# EAGLE design defi_schutz (EAGLE 9.5.2)
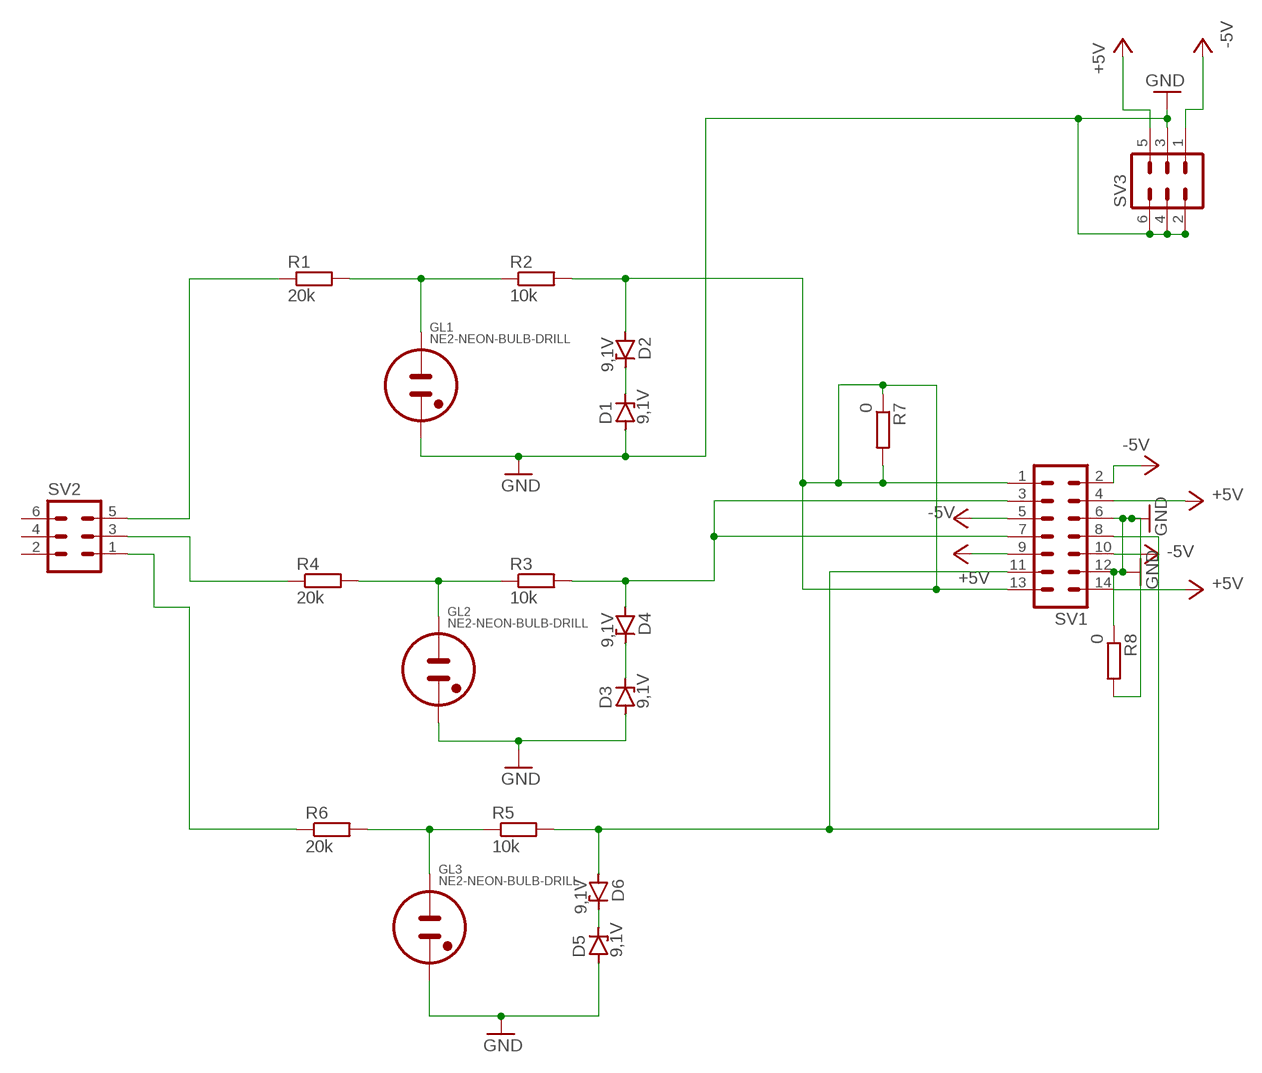
[diagram p0: schematic, sheet 1]

## Parts
D1  9,1V  1N4728  [DO41Z10]
D2  9,1V  1N4728  [DO41Z10]
D3  9,1V  1N4728  [DO41Z10]
D4  9,1V  1N4728  [DO41Z10]
D5  9,1V  1N4728  [DO41Z10]
D6  9,1V  1N4728  [DO41Z10]
GL1  NE2-NEON-BULB-DRILL  [NE2-NEON-BULB-DRILL]
GL2  NE2-NEON-BULB-DRILL  [NE2-NEON-BULB-DRILL]
GL3  NE2-NEON-BULB-DRILL  [NE2-NEON-BULB-DRILL]
R1  20k  R-EU_0207/10  [0207/10]
R2  10k  R-EU_0207/10  [0207/10]
R3  10k  R-EU_0207/10  [0207/10]
R4  20k  R-EU_0207/10  [0207/10]
R5  10k  R-EU_0207/10  [0207/10]
R6  20k  R-EU_0207/10  [0207/10]
R7  0  R-EU_0207/15  [0207/15]
R8  0  R-EU_0207/15  [0207/15]
SV1  ML14L  [ML14L]
SV2  ML6L  [ML6L]
SV3  ML6L  [ML6L]

## Nets
+5V: SV1.4 SV1.9 SV1.14 SV3.5
-5V: SV1.2 SV1.5 SV1.10 SV3.1
GND: D1.A D3.A D5.A GL1.2(A1) GL2.2(A1) GL3.2(A1) R8.1 R8.2 SV1.6 SV1.12 SV3.2 SV3.3 SV3.4 SV3.6
N$1: GL2.1(A) R3.1 R4.2
N$2: D4.A R3.2 SV1.3 SV1.7
N$3: D3.C D4.C
N$4: D1.C D2.C
N$5: GL1.1(A) R1.2 R2.1
N$6: D2.A R2.2 R7.1 R7.2 SV1.1 SV1.13
N$7: GL3.1(A) R5.1 R6.2
N$8: D6.A R5.2 SV1.8 SV1.11
N$9: D5.C D6.C
N$10: R1.1 SV2.5
N$11: R4.1 SV2.3
N$12: R6.1 SV2.1
Unconnected: SV2.2 SV2.4 SV2.6

## Library data of the parts
D1-D6 = diode:1N4728: Z DIODE 3.3 V, 1W, 5 percent
GL1-GL3 = nixie_tube:NE2-NEON-BULB: Neon indicator (wire connection)
R1-R8 = rcl:R-EU_: RESISTOR, European symbol; SPICEPREFIX: R
SV1 = con-harting-ml:ML14: HARTING; OC_FARNELL: unknown; OC_NEWARK: unknown
SV2 SV3 = con-harting-ml:ML6: HARTING; OC_FARNELL: unknown; OC_NEWARK: unknown

## Board
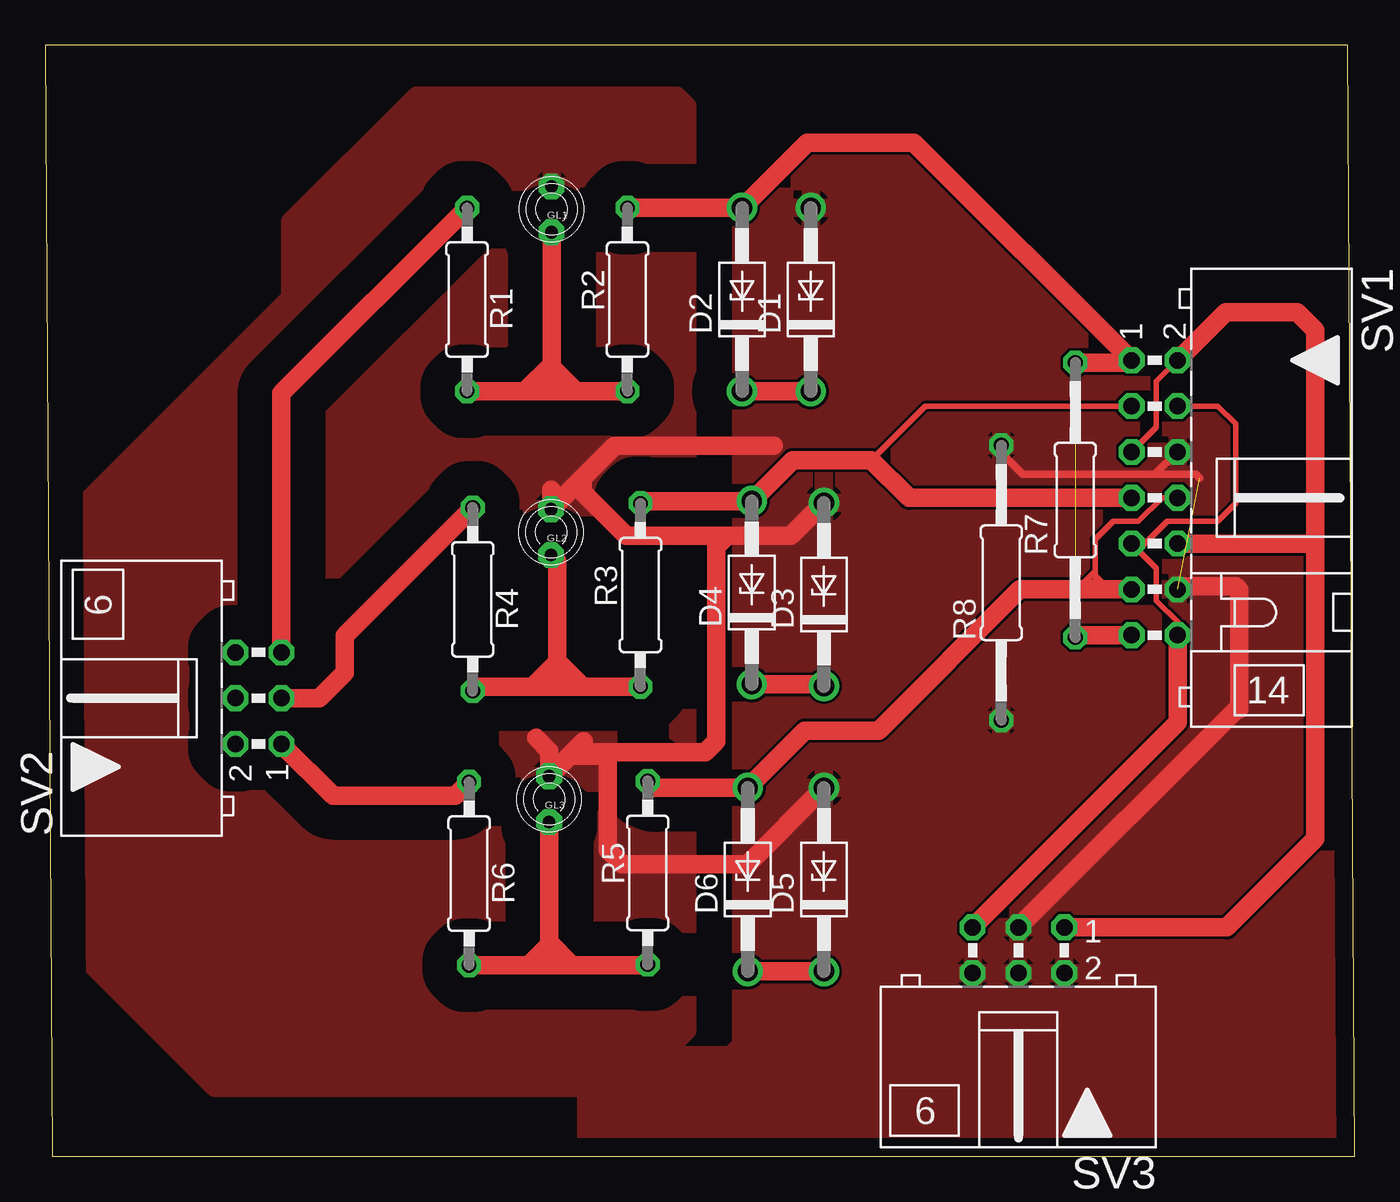
[diagram p1: board, top side]

Size 72.6 x 61.6 mm. Coordinates in mm from the lower left corner, seen from the top.
Outline: 0.4,0 72.6,0 72.2,61.6 0,61.6 0.4,0
Copper layers (1*16): Top 0.035mm / dielectric 1.5mm / Bottom 0.035mm
Design rules "default": minimum track width 6mil, minimum drill 0.35mm, track to track 6mil, track to pad 6mil, pad to pad 6mil, via to via 6mil, smd to smd 6mil, copper to edge 40mil, drill to drill 6mil, minimum pad ring 10mil, minimum via ring 8mil, stop-mask expansion 4mil, vias tented up to drill 0mil, thermal gap 10mil

### Footprints (pad centres in the part's own frame; a part is rotated, then mirrored left to right if it is on the bottom)
DO41Z10 = drill 1.118: A 5.08,0; C -5.08,0
NE2-NEON-BULB-DRILL = drill 0.7 pad 1.422 octagon: 1 0,1.27; 2 0,-1.27
0207/10 = drill 0.813 octagon: 1 -5.08,0; 2 5.08,0
0207/15 = drill 0.813 octagon: 1 -7.62,0; 2 7.62,0
ML14L = drill 0.914 octagon: 1 -7.62,-1.27; 2 -7.62,1.27; 3 -5.08,-1.27; 4 -5.08,1.27; 5 -2.54,-1.27; 6 -2.54,1.27; 7 0,-1.27; 8 0,1.27; 9 2.54,-1.27; 10 2.54,1.27; 11 5.08,-1.27; 12 5.08,1.27; 13 7.62,-1.27; 14 7.62,1.27
ML6L = drill 0.914 octagon: 1 -2.54,-1.27; 2 -2.54,1.27; 3 0,-1.27; 4 0,1.27; 5 2.54,-1.27; 6 2.54,1.27

### Placement (x,y rotation side)
D1  42.44,47.5 90 top
D2  38.63,47.5 90 top
D3  43.17,31.15 90 top
D4  39.17,31.25 90 top
D5  43.17,15.35 90 top
D6  38.95,15.35 90 top
GL1  28.07,52.5 180 top
GL2  28.05,34.6 180 top
GL3  27.94,19.8 180 top
R1  23.39,47.5 270 top
R2  32.28,47.5 90 top
R3  33,31.12 90 top
R4  23.7,30.88 270 top
R5  33.4,15.72 90 top
R6  23.5,15.68 270 top
R7  57.1,36.38 90 top
R8  53,31.8 90 top
SV1  61.5,36.51 270 top
SV2  11.83,25.4 90 top
SV3  53.95,11.43 180 top

### Tracks (layer width: path | path; a pad name or v marks a point on that pad's centre or on a via)
+5V
  Top 0.305: SV1.4 65.01,41.59 66,40.6 66,36.2 65,35.2 62.2,35.2 60.6,33.6 | 60.23,34.37 SV1.9 60.6,33.6 | SV1.14 62.77,29.63 61.6,30.8 61.6,32.6 60.6,33.6
  Top 1.016: SV3.5 62.77,24.06 SV1.14
-5V
  Top 0.305: SV1.5 61.6,40.42 61.6,42.96 SV1.2
  Top 1.016: SV1.2 65.44,46.8 69.4,46.8 70.4,45.8 70.4,34 | SV3.1 65.5,12.7 70.4,17.6 70.4,34 | SV1.10 70.37,33.97 70.4,34
GND  (1 unrouted)
  Top 0.406: SV1.6 61.52,37.8 | 53,39 54.2,37.8 61.52,37.8 | 61.52,37.8 63.8,37.8 64,37.6
  Top 1.016: GL3.2 27.94,22.47 27.21,23.2 | 28.05,36.95 GL2.2 29.79,37.61 | 29.79,37.61 31.58,39.4 40.4,39.4 | GL3.2 29.87,23 | SV1.12 62.94,31.6 66,31.6 66.2,31.4 66.2,24.8 66.05,24.8 SV3.3 | D5.A 38.94,16.2 32,16.2 31.2,17 31.2,22.2 29.07,22.2 GL3.2 | D3.A 41.34,34.4 37.8,34.4 | 37.8,34.4 32.2,34.4 29.79,36.81 29.79,37.61 | GL3.2 29.27,22.4 36.6,22.4 37.2,23 37.2,33.8 37.8,34.4
  pour Top (isolate 1.93): 35.6,7 35.6,58.2 35,58.8 20.6,58.8 13.6,51.8 13.6,47.6 -2.4,31.6 -2.4,15.6 9.4,3.8 32.4,3.8
  pour Top: 30,5.6 38,5.6 38.6,6.2 38.6,54.2 35.8,57 32.6,57 33.8,58.2 33.8,61 78,61 78,-5 30,-5
N$1
  Top 1.016: R4.2 23.94,26.04 27.2,26.04 | 27.2,26.04 28.4,26.04 | 28.4,26.04 29.8,26.04 | 29.8,26.04 R3.1 | GL2.1 28.4,32.98 28.4,27.4 | 28.4,27.4 28.4,26.04 | 27.2,26.04 27.2,26.2 28.4,27.4 | 28.4,27.4 28.44,27.4 29.8,26.04
N$2
  Top 0.305: SV1.3 48.79,41.59 45.8,38.6
  Top 1.016: R3.2 33.13,36.33 D4.A 41.44,38.6 45.8,38.6 47.89,36.51 SV1.7
N$3
  Top 1.016: D4.C 43.07,26.17 D3.C
N$4
  Top 1.016: D2.C D1.C
N$5
  Top 1.016: R1.2 26.6,42.42 | 26.6,42.42 28.2,42.42 | 28.2,42.42 29.4,42.42 | 29.4,42.42 R2.1 | GL1.1 28.07,43.89 | 28.07,43.89 26.6,42.42 | 28.07,43.75 28.07,42.55 28.2,42.42 | 28.07,43.89 28.07,43.75 | 28.07,43.75 29.4,42.42
N$6  (1 unrouted)
  Top 1.016: R2.2 D2.A 42.25,56.2 48.16,56.2 SV1.1 60.1,44 R7.2 | R7.1 57.23,28.89 SV1.13
N$7
  Top 1.016: R6.2 26.8,10.6 | 26.8,10.6 27.2,10.6 | 27.2,10.6 28.2,10.6 | 28.2,10.6 29.2,10.6 | 29.2,10.6 33.36,10.6 R5.1 | GL3.1 27.94,12.2 27.94,11.86 | 27.94,11.34 27.94,10.86 28.2,10.6 | 27.94,11.86 27.94,11.34 | 27.94,11.34 27.2,10.6 | 27.94,11.86 29.2,10.6 | 27.94,11.86 27.94,11.74 26.8,10.6
N$8
  Top 0.305: SV1.8 61.91,36.51 60.6,35.2 59.2,35.2 58.2,34.2 58.2,32.43 | 57.2,31.43 57.78,32.02 | 57.78,32.02 57.88,32.12 | 57.88,32.12 58.2,32.43 | 58.2,32.2 58.2,31.43 57.88,31.75 | 57.88,31.75 57.78,31.84 57.78,32.02 | 57.88,31.75 57.88,32.12 | 58.8,31.43 58.8,31.6 58.6,31.8 58.2,32.2 | 58.2,32.43 58.2,32.2
  Top 1.016: R5.2 33.77,20.43 D6.A 42.12,23.6 46.2,23.6 54.03,31.43 57.2,31.43 58.2,31.43 58.8,31.43 SV1.11
N$9
  Top 1.016: D6.C D5.C
N$10
  Top 1.016: R1.1 13.1,42.29 SV2.5
N$11
  Top 1.016: R4.1 16.6,28.86 16.6,26.8 15.2,25.4 SV2.3
N$12
  Top 1.016: SV2.1 15.96,20 22.74,20 R6.1